# Altium schematic sheet WATCHDOG.SchDoc
size 420 x 297 mm; SheetNumber: 20; SheetTotal: 34
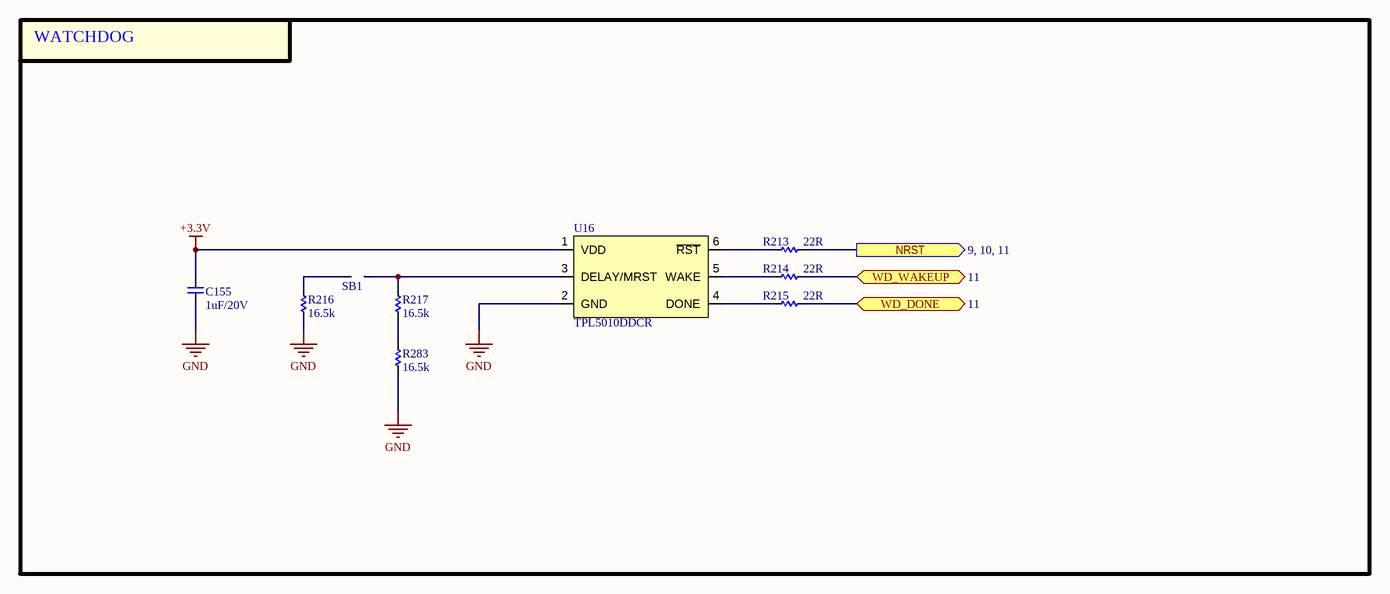
[diagram p0: WATCHDOG.SchDoc]

## Parts
C155  1uF/20V  [CAP_C_1005X50_L]
R213  22R  [RES_C_1005x30_L]
R214  22R  [RES_C_1005x30_L]
R215  22R  [RES_C_1005x30_L]
R216  16.5k  [RES_C_1005x30_L]
R217  16.5k  [RES_C_1005x30_L]
R283  16.5k  [RES_C_1005x30_L]
SB1  JUMPER  [JUMPER_1608]  (value not drawn)
U16  TPL5010DDCR  [TPL5010DDCR]

## Blocks framed on the sheet
WATCHDOG: C155 R213-R217 R283 SB1 U16

## Ports
NRST (out, see 9, 10, 11), WD_DONE (bidir, see 11), WD_WAKEUP (bidir, see 11)

## Nets
+3.3V: C155.2 U16.1(VDD)
GND: C155.1 R216.2 R283.2 U16.2(GND)
NRST: R213.2 ; port NRST
WD_DONE: R215.2 ; port WD_DONE
WD_WAKEUP: R214.2 ; port WD_WAKEUP
NetR213_1: R213.1 U16.6(~{RST})
NetR214_1: R214.1 U16.5(WAKE)
NetR215_1: R215.1 U16.4(DONE)
NetR216_1: R216.1 SB1.1
NetR217_1: R217.1 SB1.2 U16.3(DELAY/MRST)
NetR217_2: R217.2 R283.1

## Notes on the sheet
- Project:
- Sub-system:
- Design by:
- Sheet title:
- Sheet
- of
- Checked by:
- Approved by:
- Revision:
- Document No:
- Size:
- Date:
- A3

## Library data of the parts
C155 = _CAP_C_2: CAP CHIP
R213-R217 R283 = _RES_B_2: RES
U16 = TPL5010DDCR: OSC PROG TIMER TSOT23-6